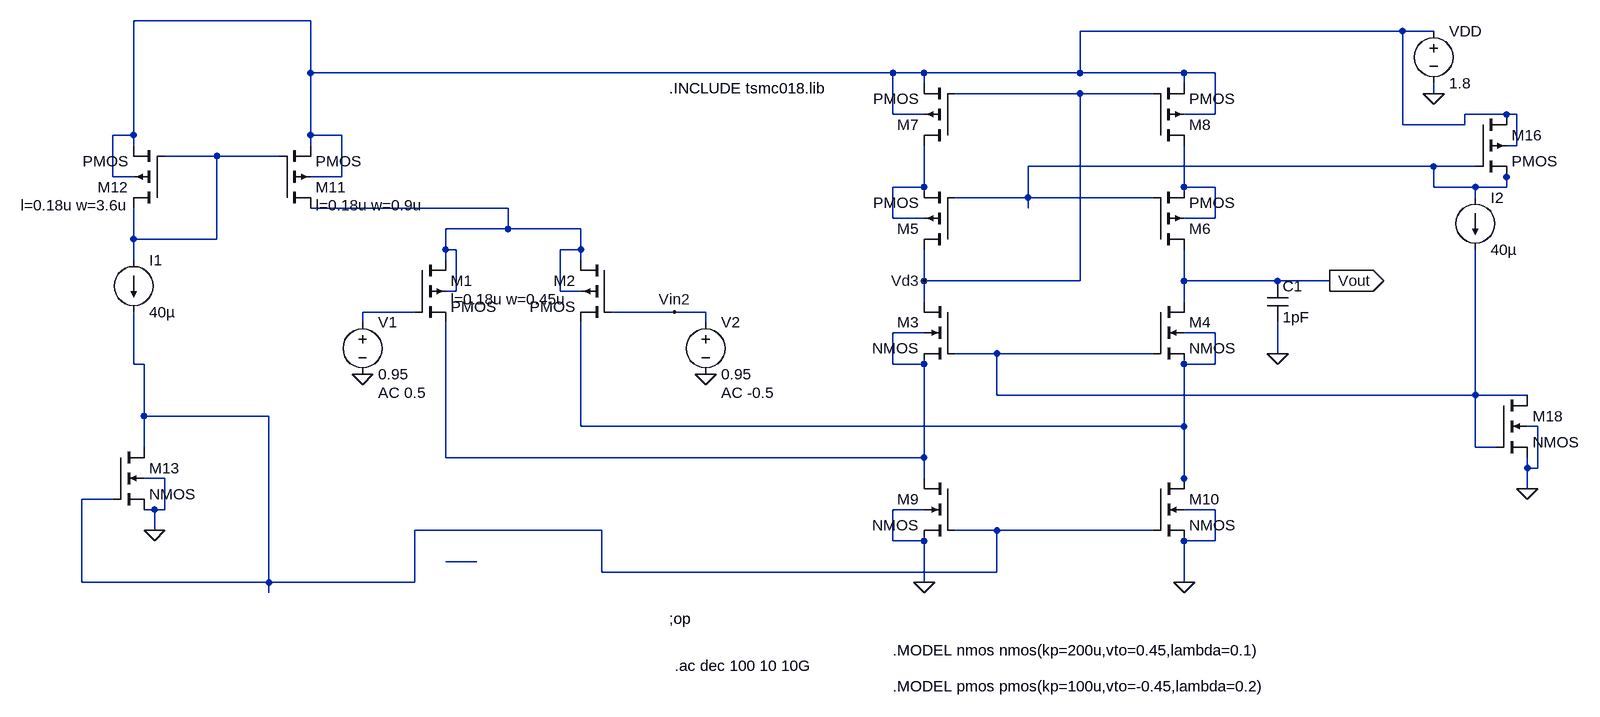
[diagram p0: schematic folded-cascode.asc]
folded-cascode.asc, the LTspice schematic file:
Version 4
SHEET 1 1876 872
WIRE -992 -464 -1264 -464
WIRE 688 -448 192 -448
WIRE 736 -448 688 -448
WIRE -992 -384 -992 -464
WIRE -96 -384 -992 -384
WIRE -48 -384 -96 -384
WIRE 192 -384 192 -448
WIRE 192 -384 -48 -384
WIRE 352 -384 192 -384
WIRE 400 -384 352 -384
WIRE -48 -368 -48 -384
WIRE 352 -368 352 -384
WIRE 192 -352 0 -352
WIRE 304 -352 192 -352
WIRE 736 -352 736 -368
WIRE -96 -320 -96 -384
WIRE -48 -320 -96 -320
WIRE 400 -320 400 -384
WIRE 400 -320 352 -320
WIRE 848 -320 784 -320
WIRE 864 -320 848 -320
WIRE 688 -304 688 -448
WIRE 784 -304 784 -320
WIRE 784 -304 688 -304
WIRE -1264 -288 -1264 -464
WIRE -1264 -288 -1296 -288
WIRE -992 -288 -992 -384
WIRE -944 -288 -992 -288
WIRE -1264 -272 -1264 -288
WIRE -992 -272 -992 -288
WIRE 864 -272 864 -320
WIRE 864 -272 848 -272
WIRE -1136 -256 -1216 -256
WIRE -1040 -256 -1136 -256
WIRE 736 -240 112 -240
WIRE 800 -240 736 -240
WIRE -1296 -224 -1296 -288
WIRE -1264 -224 -1296 -224
WIRE -944 -224 -944 -288
WIRE -944 -224 -992 -224
WIRE 848 -224 848 -240
WIRE -48 -208 -48 -272
WIRE -48 -208 -96 -208
WIRE 352 -208 352 -272
WIRE 400 -208 352 -208
WIRE 736 -208 736 -240
WIRE 800 -208 736 -208
WIRE 848 -208 848 -224
WIRE 848 -208 800 -208
WIRE 112 -192 112 -240
WIRE 112 -192 0 -192
WIRE 304 -192 112 -192
WIRE 800 -192 800 -208
WIRE -688 -176 -992 -176
WIRE 112 -176 112 -192
WIRE -96 -160 -96 -208
WIRE -48 -160 -96 -160
WIRE 400 -160 400 -208
WIRE 400 -160 352 -160
WIRE -688 -144 -688 -176
WIRE -688 -144 -784 -144
WIRE -576 -144 -688 -144
WIRE -1264 -128 -1264 -176
WIRE -1136 -128 -1136 -256
WIRE -1136 -128 -1264 -128
WIRE -784 -112 -784 -144
WIRE -768 -112 -784 -112
WIRE -576 -112 -576 -144
WIRE -576 -112 -608 -112
WIRE -1264 -96 -1264 -128
WIRE -784 -96 -784 -112
WIRE -576 -96 -576 -112
WIRE -48 -64 -48 -112
WIRE 192 -64 192 -352
WIRE 192 -64 -48 -64
WIRE 352 -64 352 -112
WIRE 496 -64 352 -64
WIRE 576 -64 496 -64
WIRE -768 -48 -768 -112
WIRE -768 -48 -784 -48
WIRE -608 -48 -608 -112
WIRE -576 -48 -608 -48
WIRE -48 -32 -48 -64
WIRE 352 -32 352 -64
WIRE -832 -16 -912 -16
WIRE -432 -16 -528 -16
WIRE -384 -16 -432 -16
WIRE -912 0 -912 -16
WIRE -384 0 -384 -16
WIRE -48 16 -96 16
WIRE 400 16 352 16
WIRE 64 48 0 48
WIRE 304 48 64 48
WIRE 496 48 496 0
WIRE -1264 64 -1264 -16
WIRE -1248 64 -1264 64
WIRE -96 64 -96 16
WIRE -48 64 -96 64
WIRE 400 64 400 16
WIRE 400 64 352 64
WIRE 64 112 64 48
WIRE 800 112 800 -112
WIRE 800 112 64 112
WIRE 880 112 800 112
WIRE -1248 144 -1248 64
WIRE -1056 144 -1248 144
WIRE -576 160 -576 0
WIRE 352 160 352 64
WIRE 352 160 -576 160
WIRE 896 160 880 160
WIRE -1248 192 -1248 144
WIRE 800 192 800 112
WIRE 832 192 800 192
WIRE -784 208 -784 0
WIRE -48 208 -48 64
WIRE -48 208 -784 208
WIRE 880 224 880 208
WIRE 896 224 896 160
WIRE 896 224 880 224
WIRE -1216 240 -1248 240
WIRE -48 240 -48 208
WIRE 352 240 352 160
WIRE 352 256 352 240
WIRE 880 256 880 224
WIRE -1296 272 -1344 272
WIRE -1232 288 -1248 288
WIRE -1216 288 -1216 240
WIRE -1216 288 -1232 288
WIRE -48 288 -96 288
WIRE 400 288 352 288
WIRE -1232 320 -1232 288
WIRE -544 320 -832 320
WIRE 64 320 0 320
WIRE 304 320 64 320
WIRE -96 336 -96 288
WIRE -48 336 -96 336
WIRE 400 336 400 288
WIRE 400 336 352 336
WIRE -736 368 -784 368
WIRE -544 384 -544 320
WIRE 64 384 64 320
WIRE 64 384 -544 384
WIRE -1344 400 -1344 272
WIRE -1056 400 -1056 144
WIRE -1056 400 -1344 400
WIRE -832 400 -832 320
WIRE -832 400 -1056 400
WIRE -48 400 -48 336
WIRE 352 400 352 336
WIRE -1056 416 -1056 400
FLAG 736 -352 0
FLAG 496 48 0
FLAG -48 -64 Vd3
FLAG -432 -16 Vin2
FLAG 576 -64 Vout
IOPIN 576 -64 Out
FLAG -912 80 0
FLAG -384 80 0
FLAG -48 400 0
FLAG 352 400 0
FLAG -1232 320 0
FLAG 880 256 0
SYMBOL voltage 736 -464 R0
WINDOW 123 0 0 Left 2
WINDOW 39 0 0 Left 2
SYMATTR InstName VDD
SYMATTR Value 1.8
SYMBOL cap 480 -64 R0
SYMATTR InstName C1
SYMATTR Value 1pF
SYMBOL voltage -912 -16 R0
WINDOW 123 24 124 Left 2
WINDOW 39 0 0 Left 2
SYMATTR Value2 AC 0.5
SYMATTR InstName V1
SYMATTR Value 0.95
SYMBOL voltage -384 -16 R0
WINDOW 123 24 124 Left 2
WINDOW 39 0 0 Left 2
SYMATTR Value2 AC -0.5
SYMATTR InstName V2
SYMATTR Value 0.95
SYMBOL pmos4 -832 -96 R0
WINDOW 123 56 60 Left 2
SYMATTR InstName M1
SYMATTR Value2 l=0.18u w=0.45u
SYMBOL pmos4 -528 -96 M0
SYMATTR InstName M2
SYMATTR Value2 l=0.18u w=0.45u
SYMBOL current -1264 -96 R0
SYMATTR InstName I1
SYMATTR Value 40µ
SYMBOL pmos4 -1040 -176 M180
WINDOW 123 56 4 Left 2
SYMATTR InstName M11
SYMATTR Value2 l=0.18u w=0.9u
SYMBOL pmos4 -1216 -176 R180
WINDOW 123 56 4 Left 2
SYMATTR InstName M12
SYMATTR Value2 l=0.18u w=3.6u
SYMBOL nmos4 -1296 192 R0
SYMATTR InstName M13
SYMATTR Value2 l=0.18u w=3.0u
SYMBOL current 800 -192 R0
SYMATTR InstName I2
SYMATTR Value 40µ
SYMBOL nmos4 832 112 R0
SYMATTR InstName M18
SYMATTR Value2 l=0.18u w=3.6u
SYMBOL pmos4 800 -320 R0
SYMATTR InstName M16
SYMATTR Value2 l=0.18u w=3.6u
SYMBOL pmos4 304 -112 M180
SYMATTR InstName M6
SYMATTR Value2 l=0.18u w=0.45u
SYMBOL pmos4 0 -112 R180
SYMATTR InstName M5
SYMATTR Value2 l=0.18u w=0.45u
SYMBOL pmos4 304 -272 M180
SYMATTR InstName M8
SYMATTR Value2 l=0.18u w=0.45u
SYMBOL pmos4 0 -272 R180
SYMATTR InstName M7
SYMATTR Value2 l=0.18u w=0.45u
SYMBOL nmos4 304 -32 R0
SYMATTR InstName M4
SYMATTR Value2 l=0.18u w=0.225u
SYMBOL nmos4 0 -32 M0
SYMATTR InstName M3
SYMATTR Value2 l=0.18u w=0.225u
SYMBOL nmos4 0 240 M0
SYMATTR InstName M9
SYMATTR Value2 l=0.18u w=0.45u
SYMBOL nmos4 304 240 R0
SYMATTR InstName M10
SYMATTR Value2 l=0.18u w=0.45u
TEXT -440 -360 Left 2 !.INCLUDE tsmc018.lib
TEXT -440 456 Left 2 !;op
TEXT -432 528 Left 2 !.ac dec 100 10 10G
TEXT -96 504 Left 2 !.MODEL nmos nmos(kp=200u,vto=0.45,lambda=0.1)
TEXT -96 560 Left 2 !.MODEL pmos pmos(kp=100u,vto=-0.45,lambda=0.2)

The netlist it stands for:
* folded-cascode.asc
VDD N001 0 1.8
C1 Vout 0 1pF
V1 N007 0 0.95 AC 0.5
V2 Vin2 0 0.95 AC -0.5
M1 N006 N007 N008 N006 PMOS l=0.18u w=0.45u
M2 N006 Vin2 N009 N006 PMOS l=0.18u w=0.45u
I1 N002 N011 40µ
M11 N006 N002 N001 N001 PMOS l=0.18u w=0.9u
M12 N002 N002 N001 N001 PMOS l=0.18u w=3.6u
M13 N011 N011 0 0 NMOS l=0.18u w=3.0u
I2 N003 N010 40µ
M18 N010 N010 0 0 NMOS l=0.18u w=3.6u
M16 N001 N003 N003 N001 PMOS l=0.18u w=3.6u
M6 Vout N003 N005 N005 PMOS l=0.18u w=0.45u
M5 Vd3 N003 N004 N004 PMOS l=0.18u w=0.45u
M8 N005 Vd3 N001 N001 PMOS l=0.18u w=0.45u
M7 N004 Vd3 N001 N001 PMOS l=0.18u w=0.45u
M4 Vout N010 N009 N009 NMOS l=0.18u w=0.225u
M3 Vd3 N010 N008 N008 NMOS l=0.18u w=0.225u
M9 N008 N011 0 0 NMOS l=0.18u w=0.45u
M10 N009 N011 0 0 NMOS l=0.18u w=0.45u
.model NMOS NMOS
.model PMOS PMOS
.lib standard.mos
.INCLUDE tsmc018.lib
;op
.ac dec 100 10 10G
.MODEL nmos nmos(kp=200u,vto=0.45,lambda=0.1)
.MODEL pmos pmos(kp=100u,vto=-0.45,lambda=0.2)
.backanno
.end